# Altium schematic sheet Analog.SchDoc: HM-CORE Analog Input
size A4; PageSetup: Record=PageOptions|CenterHorizontal=True|CenterVertical=True|PrintScale=0.96|XCorrection=1.00|YCorrection=1.00|PrintKind=0|BorderSize=5000000|LeftOffset=0|BottomOffset=0|Orientation=2|PaperLength=1000|PaperWidth=1000|Scale=100|PaperSource=7|PrintQuality=-4|MediaType=1|DitherType=10|PaperKind=A4|PrintScaleMode=1; Organization: Trenz Electronic GmbH; Revision: A; SheetNumber: 7; SheetTotal: 12; Date: 08.07.2015; Author: Indrek Tubalkain; CompanyName: Trenz Electronic GmbH; DrawnBy: Indrek Tubalkain; Engineer: Indrek Tubalkain; ProjectName: TE0723 Arduino
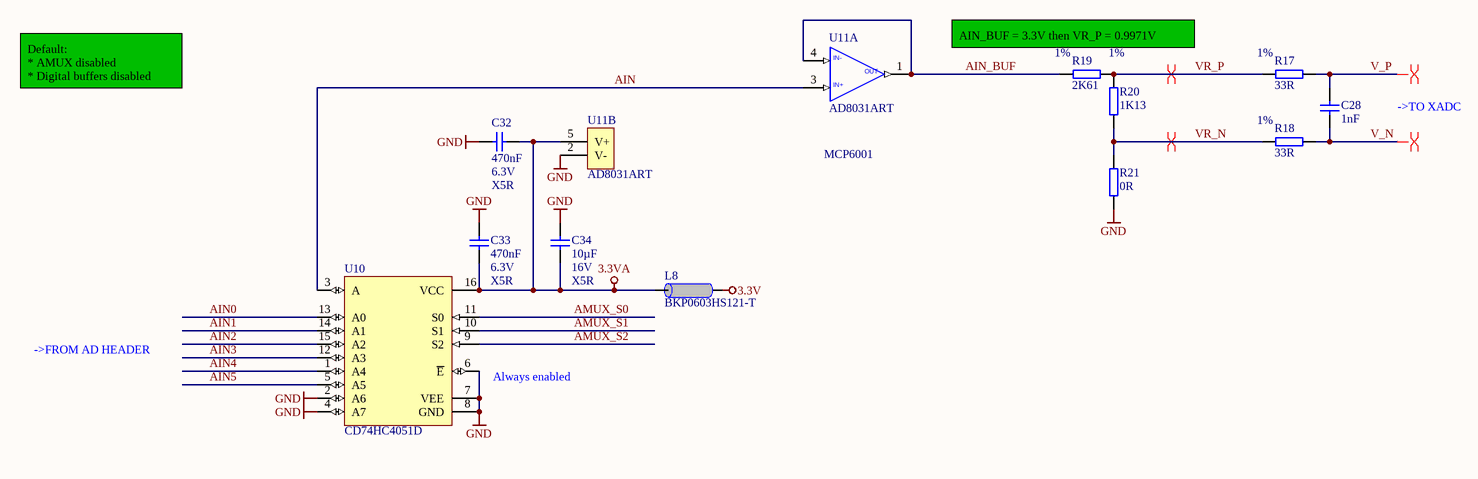
[diagram p0: Analog.SchDoc]

## Parts
C28  1nF  [CAPC1005X55N]
C32  470nF  Voltage: 6.3V  Technology: X5R  [CAPC0603X33N]
C33  470nF  Voltage: 6.3V  Technology: X5R  [CAPC0603X33N]
C34  10µF  Voltage: 16V  Technology: X5R  [CAPC1608X90N]
L8  BKP0603HS121-T  [INDC0603X33N]
R17  33R  Tolerance: 1%  [RESC0603X26N]
R18  33R  Tolerance: 1%  [RESC0603X26N]
R19  2K61  Tolerance: 1%  [RESC1005X40N]
R20  1K13  Tolerance: 1%  [RESC1005X40N]
R21  0R  [RESC1005X40N]
U10  CD74HC4051D  [SOIC127P600X175-16N]
U11  AD8031ART  [SOT95P280X145-5N]  (parts A,B of 2)

## Nets
3.3V: L8.1
3.3VA: C32.2 C33.1 C34.2 L8.2 U10.16(VCC) U11.5(V+)
GND: C32.1 C33.2 C34.1 R21.2 U10.2(A6) U10.4(A7) U10.6(~{E}) U10.7(VEE) U10.8(GND) U11.2(V-)
AIN: U10.3(A) U11.3(IN+)
AIN0: U10.13(A0)
AIN1: U10.14(A1)
AIN2: U10.15(A2)
AIN3: U10.12(A3)
AIN4: U10.1(A4)
AIN5: U10.5(A5)
AIN_BUF: R19.1 U11.1(OUT) U11.4(IN-)
AMUX_S0: U10.11(S0)
AMUX_S1: U10.10(S1)
AMUX_S2: U10.9(S2)
V_N: C28.2 R18.2
V_P: C28.1 R17.2
VR_N: R18.1 R20.2 R21.1
VR_P: R17.1 R19.2 R20.1

## Layout directives
differential pair: V_N, V_P, VR_N, VR_P

## Notes on the sheet
- AIN_BUF = 3.3V then VR_P = 0.9971V
- Default:
  * AMUX disabled
  * Digital buffers disabled
- ->TO XADC
- MCP6001
- ->FROM AD HEADER
- (near U10) Always enabled
- Name:
- Size:
- A4
- Number:
- Revision:
- Designed by Trenz Electronic and changed by HMLAB
- OPEN SOURCE HARDWARE
- For more information, please visit: www.hm-lab.com/hm-core <http://hm-lab.com/hm-core>
- Date:
- Time:
- Sheet
- of

## Library data of the parts
C28 = 26184: KON 1nF 50V SMD AEC-Q200; AN: 26184; Tolerance: 10%; Mixed: SMT; Value: 1n; Case: 1005 (0402); Voltage: 50V; Technology: X7R
C32 C33 = 24921: KON 470nF X5R 6.3V SMD 20%; AN: 24921; Value: 470n; Mixed: SMT; Preferred: Yes; Case: 0603 (0201); Tolerance: 20%
C34 = 25341: KON 10µF 16V X5R SMD 20%; AN: 25341; Mixed: SMT; Value: 10u; Preferred: Yes; Case: 1608 (0603); Tolerance: 20%
L8 = 25393: Ferritdurchführung SMD 0201; AN: 25393; Mixed: SMT; Trenz-Stock: Yes; Tolerance: 25%; Case: 0603 (0201); HelpURL: B:\AD\adlib\datasheet\MULTILAYER CHIP BEAD INDUCTORS BK; Preferred: Yes
R17 R18 = 25021: WID SMD 33R 1% 0,05W; AN: 25021; Mixed: SMT; Value: 33; Preferred: Yes; Case: 0603 (0201); HelpURL: B:\AD\adlib\datasheet\R0201
R19 = 23730: WID SMD 2K61 1% 0,063W; AN: 23730; Mixed: SMT; Value: 2.61K; Preferred: Yes; Case: 1005 (0402)
R20 = 23160: WID SMD 1K13 1% 0,063W; AN: 23160; Mixed: SMT; Value: 1.13K; Preferred: Yes; Case: 1005 (0402)
R21 = 26222: WID SMD 0R 1% 0.063W AEC-Q200; AN: 26222; Mixed: SMT; Value: 0; Preferred: Yes; Case: 1005 (0402)
U10 = 26538: AN: 26538; Mixed: SMT; Trenz-Stock: Yes; Case: SOIC16 D (R-PDSO-G16); HelpURL: B:\AD\adlib\datasheet\74HCx4051
U11 = 25377: AN: 25377; Mixed: SMT; Trenz-Stock: Yes; Case: SOT23-5; HelpURL: B:\AD\adlib\datasheet\AD8031